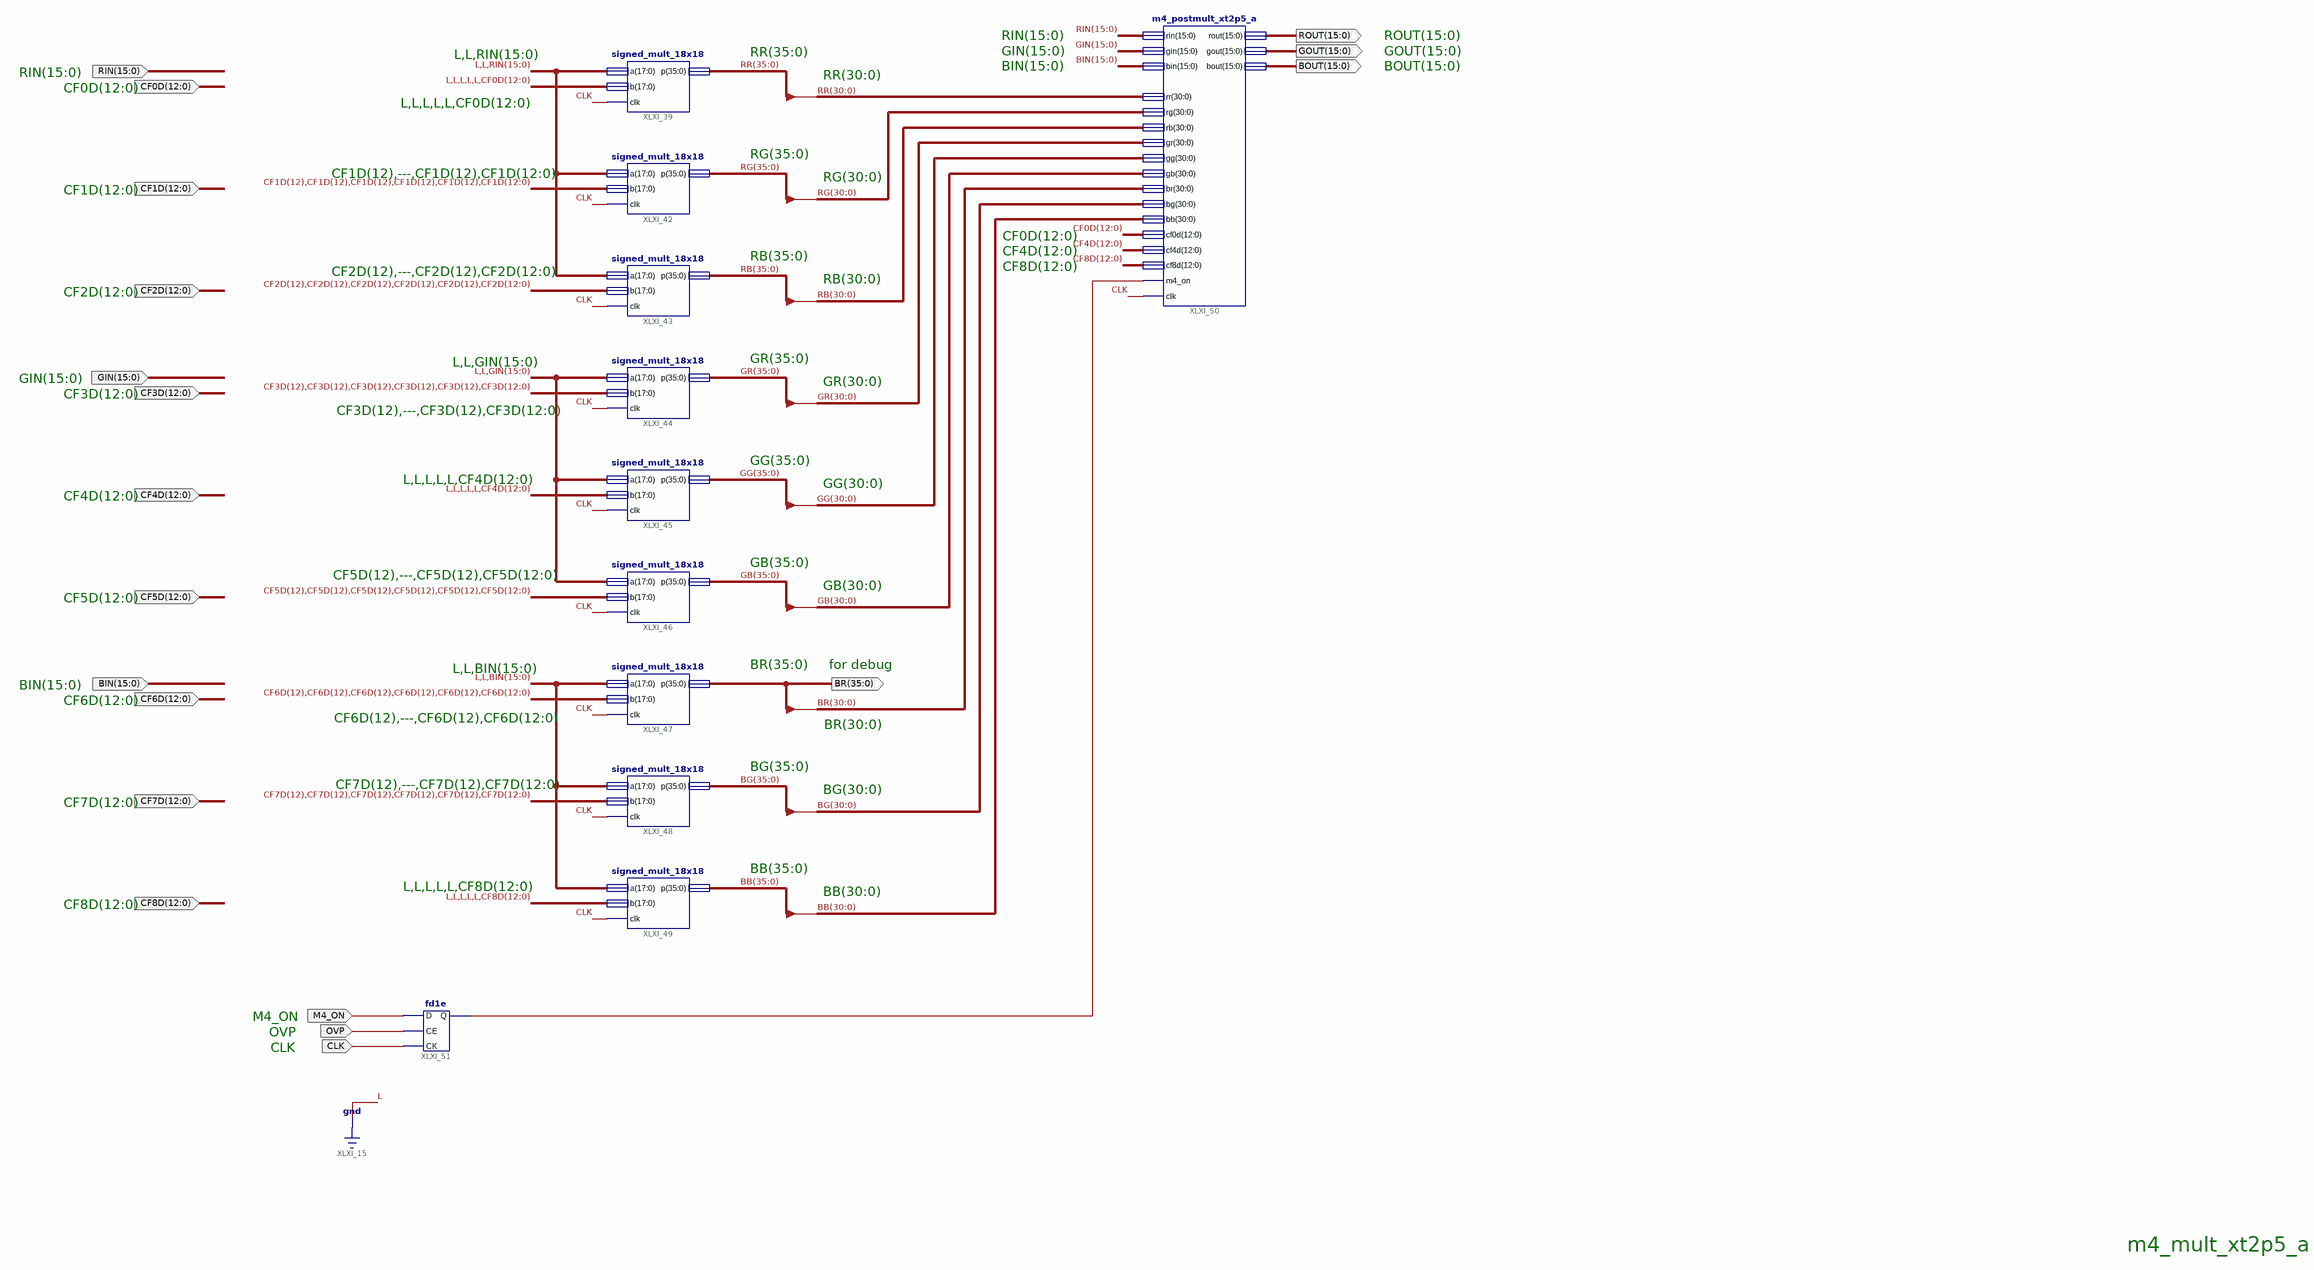
[diagram p0: schematic sheet 1]
// Xilinx ISE schematic m4_mult_xt2p5_a.sch (spartan6) as structural Verilog: 11 symbols, 19 ports
module m4_mult_xt2p5_a (
  input  [12:0] CF0D,
  input  CLK,
  input  [12:0] CF4D,
  input  [15:0] RIN,
  input  [15:0] GIN,
  input  [12:0] CF8D,
  input  [15:0] BIN,
  input  M4_ON,
  input  [12:0] CF1D,
  input  [12:0] CF2D,
  input  [12:0] CF3D,
  input  [12:0] CF5D,
  input  [12:0] CF6D,
  input  [12:0] CF7D,
  input  OVP,
  output [15:0] ROUT,
  output [15:0] GOUT,
  output [15:0] BOUT,
  output [35:0] BR
);

  wire XLXN_1;
  wire [35:0] BB, BG, GB, GG, GR, RB, RG, RR;

  signed_mult_18x18 XLXI_39 (.clk(CLK), .a({2'b00, RIN}), .b({{5{1'b0}}, CF0D}), .p(RR));
  signed_mult_18x18 XLXI_42 (.clk(CLK), .a({2'b00, RIN}), .b({{6{CF1D[12]}}, CF1D[11:0]}), .p(RG));
  signed_mult_18x18 XLXI_43 (.clk(CLK), .a({2'b00, RIN}), .b({{6{CF2D[12]}}, CF2D[11:0]}), .p(RB));
  signed_mult_18x18 XLXI_44 (.clk(CLK), .a({2'b00, GIN}), .b({{6{CF3D[12]}}, CF3D[11:0]}), .p(GR));
  signed_mult_18x18 XLXI_45 (.clk(CLK), .a({2'b00, GIN}), .b({{5{1'b0}}, CF4D}), .p(GG));
  signed_mult_18x18 XLXI_46 (.clk(CLK), .a({2'b00, GIN}), .b({{6{CF5D[12]}}, CF5D[11:0]}), .p(GB));
  signed_mult_18x18 XLXI_47 (.clk(CLK), .a({2'b00, BIN}), .b({{6{CF6D[12]}}, CF6D[11:0]}), .p(BR));
  signed_mult_18x18 XLXI_48 (.clk(CLK), .a({2'b00, BIN}), .b({{6{CF7D[12]}}, CF7D[11:0]}), .p(BG));
  signed_mult_18x18 XLXI_49 (.clk(CLK), .a({2'b00, BIN}), .b({{5{1'b0}}, CF8D}), .p(BB));
  m4_postmult_xt2p5_a XLXI_50 (
    .m4_on(XLXN_1), .clk(CLK), .rin(RIN), .gin(GIN), .bin(BIN), .rr(RR[30:0]), .rg(RG[30:0]), .rb(RB[30:0]),
    .gr(GR[30:0]), .gg(GG[30:0]), .gb(GB[30:0]), .br(BR[30:0]), .bg(BG[30:0]), .bb(BB[30:0]), .cf0d(CF0D),
    .cf4d(CF4D), .cf8d(CF8D), .rout(ROUT), .gout(GOUT), .bout(BOUT));
  fd1e XLXI_51 (.CE(OVP), .CK(CLK), .D(M4_ON), .Q(XLXN_1));

  // Notes on the sheet:
  //   RIN(15:0)
  //   ROUT(15:0)
  //   GIN(15:0)
  //   GOUT(15:0)
  //   RR(35:0)
  //   L,L,RIN(15:0)
  //   BIN(15:0)
  //   BOUT(15:0)
  //   RIN(15:0)
  //   RR(30:0)
  //   CF0D(12:0)
  //   L,L,L,L,L,CF0D(12:0)
  //   RG(35:0)
  //   CF1D(12),---,CF1D(12),CF1D(12:0)
  //   RG(30:0)
  //   CF1D(12:0)
  //   CF0D(12:0)
  //   CF4D(12:0)
  //   RB(35:0)
  //   CF8D(12:0)
  //   CF2D(12),---,CF2D(12),CF2D(12:0)
  //   RB(30:0)
  //   CF2D(12:0)
  //   GR(35:0)
  //   L,L,GIN(15:0)
  //   GIN(15:0)
  //   GR(30:0)
  //   CF3D(12:0)
  //   CF3D(12),---,CF3D(12),CF3D(12:0)
  //   GG(35:0)
  //   L,L,L,L,L,CF4D(12:0)
  //   GG(30:0)
  //   CF4D(12:0)
  //   GB(35:0)
  //   CF5D(12),---,CF5D(12),CF5D(12:0)
  //   GB(30:0)
  //   CF5D(12:0)
  //   BR(35:0)
  //   for debug
  //   L,L,BIN(15:0)
  //   BIN(15:0)
  //   CF6D(12:0)
  //   CF6D(12),---,CF6D(12),CF6D(12:0)
  //   BR(30:0)
  //   BG(35:0)
  //   CF7D(12),---,CF7D(12),CF7D(12:0)
  //   BG(30:0)
  //   CF7D(12:0)
  //   BB(35:0)
  //   L,L,L,L,L,CF8D(12:0)
  //   BB(30:0)
  //   CF8D(12:0)
  //   M4_ON
  //   OVP
  //   CLK
  //   m4_mult_xt2p5_a
endmodule
